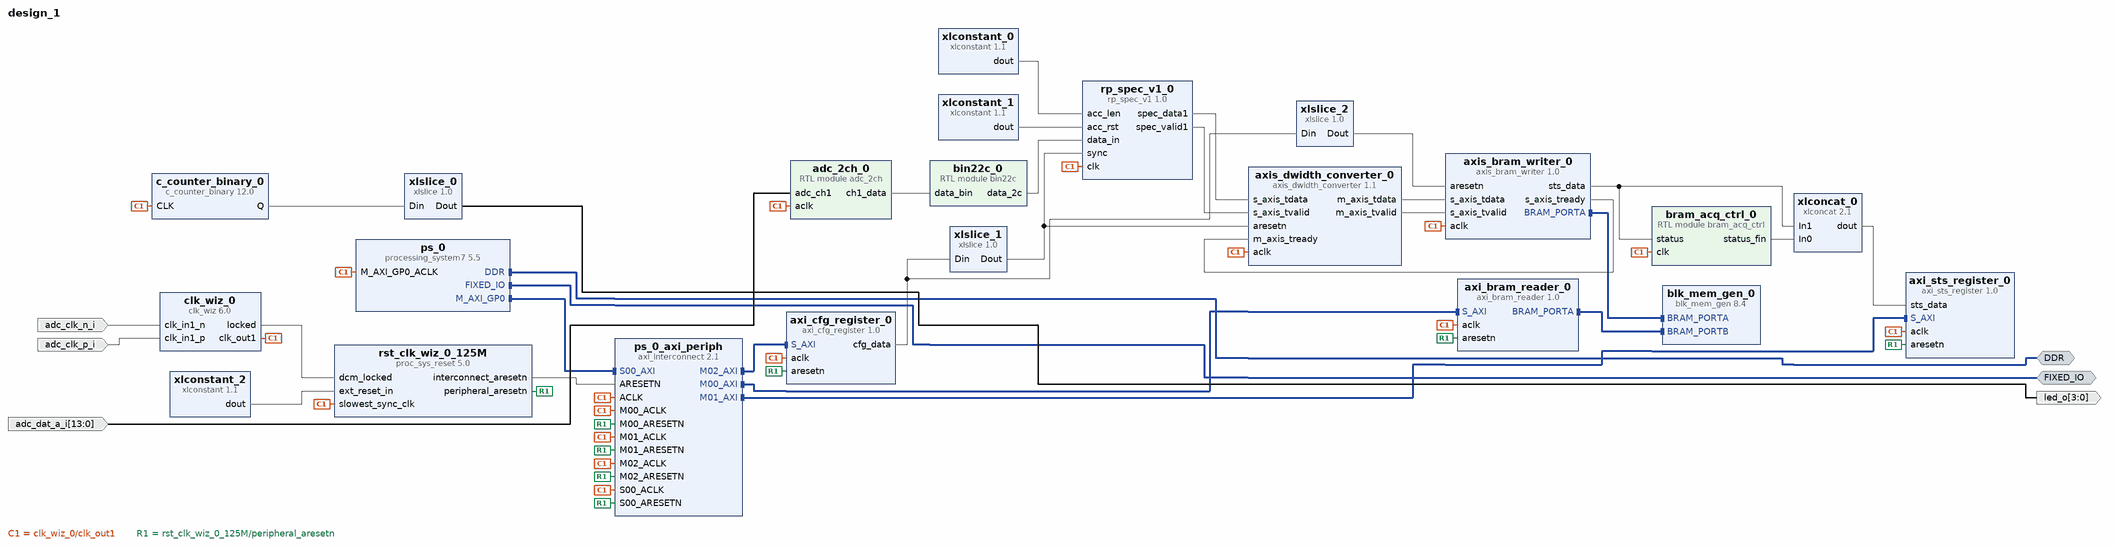
[diagram p0: block diagram of the top level]
# Vivado block design design_1, xc7z010clg400-1, Vivado 2018.2
create_bd_design design_1

create_bd_intf_port -mode Master -vlnv xilinx.com:interface:ddrx_rtl:1.0 DDR
create_bd_intf_port -mode Master -vlnv xilinx.com:display_processing_system7:fixedio_rtl:1.0 FIXED_IO
create_bd_port -dir I -type clk adc_clk_n_i
create_bd_port -dir I -type clk adc_clk_p_i
create_bd_port -dir I -from 13 -to 0 adc_dat_a_i
create_bd_port -dir O -from 3 -to 0 led_o

create_bd_cell -type ip -vlnv xilinx.com:ip:xlconstant:1.1 xlconstant_0
set_property -dict {CONFIG.CONST_WIDTH 32 CONFIG.CONST_VAL 4096} [get_bd_cells xlconstant_0]
create_bd_cell -type ip -vlnv xilinx.com:ip:clk_wiz:6.0 clk_wiz_0
set_property -dict [list \
  CONFIG.PRIMITIVE MMCM \
  CONFIG.PRIM_IN_FREQ 125 \
  CONFIG.CLKIN1_JITTER_PS 80.0 \
  CONFIG.CLKOUT1_REQUESTED_OUT_FREQ 125 \
  CONFIG.PRIM_SOURCE Differential_clock_capable_pin \
  CONFIG.CLKOUT1_DRIVES BUFG \
  CONFIG.CLKOUT2_DRIVES BUFG \
  CONFIG.CLKOUT3_DRIVES BUFG \
  CONFIG.CLKOUT4_DRIVES BUFG \
  CONFIG.CLKOUT5_DRIVES BUFG \
  CONFIG.CLKOUT6_DRIVES BUFG \
  CONFIG.CLKOUT7_DRIVES BUFG \
  CONFIG.FEEDBACK_SOURCE FDBK_AUTO \
  CONFIG.USE_RESET false \
  CONFIG.MMCM_DIVCLK_DIVIDE 1 \
  CONFIG.MMCM_CLKFBOUT_MULT_F 8.000 \
  CONFIG.MMCM_CLKIN1_PERIOD 8.000 \
  CONFIG.MMCM_CLKIN2_PERIOD 10.000 \
  CONFIG.MMCM_COMPENSATION ZHOLD \
  CONFIG.MMCM_CLKOUT0_DIVIDE_F 8.000 \
  CONFIG.CLKOUT1_JITTER 119.348 \
  CONFIG.CLKOUT1_PHASE_ERROR 96.948 \
] [get_bd_cells clk_wiz_0]
create_bd_cell -type ip -vlnv xilinx.com:ip:processing_system7:5.5 ps_0
set_property -dict [list \
  CONFIG.PCW_UIPARAM_DDR_FREQ_MHZ 533.333333 \
  CONFIG.PCW_APU_PERIPHERAL_FREQMHZ 666.666666 \
  CONFIG.PCW_SDIO_PERIPHERAL_FREQMHZ 100 \
  CONFIG.PCW_UART_PERIPHERAL_FREQMHZ 100 \
  CONFIG.PCW_I2C_PERIPHERAL_FREQMHZ 111.111115 \
  CONFIG.PCW_FPGA0_PERIPHERAL_FREQMHZ 50 \
  CONFIG.PCW_FPGA1_PERIPHERAL_FREQMHZ 50 \
  CONFIG.PCW_IMPORT_BOARD_PRESET /home/mugundhan/vivado_projects/red_pitaya/red-pitaya-notes-master/cfg/red_pitaya.xml \
  CONFIG.PCW_PRESET_BANK1_VOLTAGE {LVCMOS 2.5V} \
  CONFIG.PCW_UIPARAM_DDR_BUS_WIDTH {16 Bit} \
  CONFIG.PCW_UIPARAM_DDR_PARTNO {MT41J256M16 RE-125} \
  CONFIG.PCW_QSPI_PERIPHERAL_ENABLE 0 \
  CONFIG.PCW_ENET0_PERIPHERAL_ENABLE 1 \
  CONFIG.PCW_ENET0_ENET0_IO {MIO 16 .. 27} \
  CONFIG.PCW_ENET0_GRP_MDIO_ENABLE 1 \
  CONFIG.PCW_ENET0_GRP_MDIO_IO {MIO 52 .. 53} \
  CONFIG.PCW_ENET_RESET_ENABLE 1 \
  CONFIG.PCW_ENET_RESET_SELECT {Share reset pin} \
  CONFIG.PCW_ENET0_RESET_ENABLE 0 \
  CONFIG.PCW_SD0_PERIPHERAL_ENABLE 1 \
  CONFIG.PCW_SD0_SD0_IO {MIO 40 .. 45} \
  CONFIG.PCW_SD0_GRP_CD_ENABLE 1 \
  CONFIG.PCW_SD0_GRP_CD_IO {MIO 46} \
  CONFIG.PCW_SD0_GRP_WP_ENABLE 1 \
  CONFIG.PCW_SD0_GRP_WP_IO {MIO 47} \
  CONFIG.PCW_UART0_PERIPHERAL_ENABLE 1 \
  CONFIG.PCW_UART0_UART0_IO {MIO 14 .. 15} \
  CONFIG.PCW_UART1_PERIPHERAL_ENABLE 1 \
  CONFIG.PCW_UART1_UART1_IO {MIO 8 .. 9} \
  CONFIG.PCW_SPI0_PERIPHERAL_ENABLE 1 \
  CONFIG.PCW_SPI0_SPI0_IO EMIO \
  CONFIG.PCW_SPI1_PERIPHERAL_ENABLE 1 \
  CONFIG.PCW_SPI1_SPI1_IO {MIO 10 .. 15} \
  CONFIG.PCW_USB0_PERIPHERAL_ENABLE 1 \
  CONFIG.PCW_USB0_USB0_IO {MIO 28 .. 39} \
  CONFIG.PCW_USB_RESET_ENABLE 1 \
  CONFIG.PCW_USB_RESET_SELECT {Share reset pin} \
  CONFIG.PCW_USB0_RESET_ENABLE 1 \
  CONFIG.PCW_USB0_RESET_IO {MIO 48} \
  CONFIG.PCW_I2C0_PERIPHERAL_ENABLE 1 \
  CONFIG.PCW_I2C0_I2C0_IO {MIO 50 .. 51} \
  CONFIG.PCW_I2C0_GRP_INT_ENABLE 0 \
  CONFIG.PCW_I2C_RESET_ENABLE 1 \
  CONFIG.PCW_I2C_RESET_SELECT {Share reset pin} \
  CONFIG.PCW_GPIO_PERIPHERAL_ENABLE 1 \
  CONFIG.PCW_GPIO_MIO_GPIO_ENABLE 1 \
  CONFIG.PCW_GPIO_MIO_GPIO_IO MIO \
  CONFIG.PCW_GPIO_EMIO_GPIO_ENABLE 1 \
  CONFIG.PCW_GPIO_EMIO_GPIO_IO 64 \
] [get_bd_cells ps_0]
# 429 more settings of ps_0 are not shown: defaults, MIO pin electricals, DDR timing, and values the tool derives
create_bd_cell -type module -reference adc_2ch adc_2ch_0
create_bd_cell -type module -reference bin22c bin22c_0
create_bd_cell -type ip -vlnv xilinx.com:ip:c_counter_binary:12.0 c_counter_binary_0
set_property -dict {CONFIG.Output_Width 32 CONFIG.CE false} [get_bd_cells c_counter_binary_0]
create_bd_cell -type ip -vlnv xilinx.com:ip:xlslice:1.0 xlslice_0
set_property -dict {CONFIG.DIN_TO 26 CONFIG.DIN_FROM 29 CONFIG.DOUT_WIDTH 4} [get_bd_cells xlslice_0]
create_bd_cell -type ip -vlnv xilinx.com:ip:xlconstant:1.1 xlconstant_1
set_property -dict {CONFIG.CONST_WIDTH 1 CONFIG.CONST_VAL 0} [get_bd_cells xlconstant_1]
create_bd_cell -type ip -vlnv User_Company:SysGen:rp_spec_v1:1.0 rp_spec_v1_0
create_bd_cell -type ip -vlnv xilinx.com:ip:blk_mem_gen:8.4 blk_mem_gen_0
set_property -dict [list \
  CONFIG.Memory_Type True_Dual_Port_RAM \
  CONFIG.Enable_32bit_Address false \
  CONFIG.Use_Byte_Write_Enable true \
  CONFIG.Byte_Size 8 \
  CONFIG.Write_Width_A 64 \
  CONFIG.Write_Depth_A 1024 \
  CONFIG.Read_Width_A 64 \
  CONFIG.Enable_A Always_Enabled \
  CONFIG.Write_Width_B 32 \
  CONFIG.Read_Width_B 32 \
  CONFIG.Enable_B Always_Enabled \
  CONFIG.Register_PortA_Output_of_Memory_Primitives true \
  CONFIG.Register_PortB_Output_of_Memory_Primitives false \
  CONFIG.Use_RSTA_Pin false \
  CONFIG.Additional_Inputs_for_Power_Estimation false \
  CONFIG.Port_B_Clock 100 \
  CONFIG.Port_B_Write_Rate 50 \
  CONFIG.Port_B_Enable_Rate 100 \
  CONFIG.use_bram_block Stand_Alone \
] [get_bd_cells blk_mem_gen_0]
create_bd_cell -type ip -vlnv pavel-demin:user:axis_bram_writer:1.0 axis_bram_writer_0
set_property -dict [list \
  CONFIG.AXIS_TDATA_WIDTH 64 \
  CONFIG.BRAM_DATA_WIDTH 64 \
  CONFIG.BRAM_ADDR_WIDTH 10 \
] [get_bd_cells axis_bram_writer_0]
create_bd_cell -type ip -vlnv pavel-demin:user:axi_bram_reader:1.0 axi_bram_reader_0
set_property -dict {CONFIG.AXI_ADDR_WIDTH 32 CONFIG.BRAM_ADDR_WIDTH 11} [get_bd_cells axi_bram_reader_0]
create_bd_cell -type ip -vlnv pavel-demin:user:axi_sts_register:1.0 axi_sts_register_0
set_property -dict {CONFIG.STS_DATA_WIDTH 32 CONFIG.AXI_ADDR_WIDTH 32} [get_bd_cells axi_sts_register_0]
create_bd_cell -type ip -vlnv xilinx.com:ip:axi_interconnect:2.1 ps_0_axi_periph
set_property -dict {CONFIG.NUM_MI 3} [get_bd_cells ps_0_axi_periph]
create_bd_cell -type ip -vlnv xilinx.com:ip:proc_sys_reset:5.0 rst_clk_wiz_0_125M
create_bd_cell -type ip -vlnv xilinx.com:ip:xlconstant:1.1 xlconstant_2
create_bd_cell -type ip -vlnv pavel-demin:user:axi_cfg_register:1.0 axi_cfg_register_0
set_property -dict {CONFIG.CFG_DATA_WIDTH 32 CONFIG.AXI_ADDR_WIDTH 32} [get_bd_cells axi_cfg_register_0]
create_bd_cell -type ip -vlnv xilinx.com:ip:xlslice:1.0 xlslice_1
create_bd_cell -type ip -vlnv xilinx.com:ip:xlslice:1.0 xlslice_2
set_property -dict {CONFIG.DIN_TO 1 CONFIG.DIN_FROM 1} [get_bd_cells xlslice_2]
create_bd_cell -type ip -vlnv xilinx.com:ip:axis_dwidth_converter:1.1 axis_dwidth_converter_0
set_property -dict {CONFIG.S_TDATA_NUM_BYTES 4 CONFIG.M_TDATA_NUM_BYTES 8} [get_bd_cells axis_dwidth_converter_0]
create_bd_cell -type module -reference bram_acq_ctrl bram_acq_ctrl_0
create_bd_cell -type ip -vlnv xilinx.com:ip:xlconcat:2.1 xlconcat_0
set_property -dict {CONFIG.IN0_WIDTH 1 CONFIG.IN1_WIDTH 10} [get_bd_cells xlconcat_0]

# ---- connections ----

connect_bd_intf_net [get_bd_intf_pins ps_0/M_AXI_GP0] [get_bd_intf_pins ps_0_axi_periph/S00_AXI]
connect_bd_intf_net [get_bd_intf_pins ps_0_axi_periph/M00_AXI] [get_bd_intf_pins axi_bram_reader_0/S_AXI]
connect_bd_intf_net [get_bd_intf_pins ps_0_axi_periph/M01_AXI] [get_bd_intf_pins axi_sts_register_0/S_AXI]
connect_bd_intf_net [get_bd_intf_pins ps_0_axi_periph/M02_AXI] [get_bd_intf_pins axi_cfg_register_0/S_AXI]
connect_bd_intf_net [get_bd_intf_pins axis_bram_writer_0/BRAM_PORTA] [get_bd_intf_pins blk_mem_gen_0/BRAM_PORTA]
connect_bd_intf_net [get_bd_intf_pins blk_mem_gen_0/BRAM_PORTB] [get_bd_intf_pins axi_bram_reader_0/BRAM_PORTA]
connect_bd_intf_net [get_bd_intf_ports DDR] [get_bd_intf_pins ps_0/DDR]
connect_bd_intf_net [get_bd_intf_ports FIXED_IO] [get_bd_intf_pins ps_0/FIXED_IO]
connect_bd_net [get_bd_pins clk_wiz_0/clk_out1] \
  [get_bd_pins adc_2ch_0/aclk] [get_bd_pins ps_0/M_AXI_GP0_ACLK] [get_bd_pins c_counter_binary_0/CLK] \
  [get_bd_pins rp_spec_v1_0/clk] [get_bd_pins axis_bram_writer_0/aclk] [get_bd_pins axi_bram_reader_0/aclk] \
  [get_bd_pins axi_sts_register_0/aclk] [get_bd_pins rst_clk_wiz_0_125M/slowest_sync_clk] \
  [get_bd_pins axi_cfg_register_0/aclk] [get_bd_pins axis_dwidth_converter_0/aclk] [get_bd_pins bram_acq_ctrl_0/clk] \
  [get_bd_pins ps_0_axi_periph/ACLK] [get_bd_pins ps_0_axi_periph/S00_ACLK] [get_bd_pins ps_0_axi_periph/M00_ACLK] \
  [get_bd_pins ps_0_axi_periph/M01_ACLK] [get_bd_pins ps_0_axi_periph/M02_ACLK]
connect_bd_net -net clk_in1_n_0_1 [get_bd_ports adc_clk_n_i] [get_bd_pins clk_wiz_0/clk_in1_n]
connect_bd_net -net clk_in1_p_0_1 [get_bd_ports adc_clk_p_i] [get_bd_pins clk_wiz_0/clk_in1_p]
connect_bd_net -net adc_ch1_0_1 [get_bd_ports adc_dat_a_i] [get_bd_pins adc_2ch_0/adc_ch1]
connect_bd_net [get_bd_pins adc_2ch_0/ch1_data] [get_bd_pins bin22c_0/data_bin]
connect_bd_net [get_bd_pins c_counter_binary_0/Q] [get_bd_pins xlslice_0/Din]
connect_bd_net [get_bd_pins xlslice_0/Dout] [get_bd_ports led_o]
connect_bd_net [get_bd_pins xlconstant_0/dout] [get_bd_pins rp_spec_v1_0/acc_len]
connect_bd_net [get_bd_pins xlconstant_1/dout] [get_bd_pins rp_spec_v1_0/acc_rst]
connect_bd_net [get_bd_pins bin22c_0/data_2c] [get_bd_pins rp_spec_v1_0/data_in]
connect_bd_net [get_bd_pins rst_clk_wiz_0_125M/peripheral_aresetn] \
  [get_bd_pins axi_cfg_register_0/aresetn] [get_bd_pins axi_sts_register_0/aresetn] [get_bd_pins axi_bram_reader_0/aresetn] \
  [get_bd_pins ps_0_axi_periph/S00_ARESETN] [get_bd_pins ps_0_axi_periph/M00_ARESETN] \
  [get_bd_pins ps_0_axi_periph/M01_ARESETN] [get_bd_pins ps_0_axi_periph/M02_ARESETN]
connect_bd_net [get_bd_pins rst_clk_wiz_0_125M/interconnect_aresetn] [get_bd_pins ps_0_axi_periph/ARESETN]
connect_bd_net [get_bd_pins xlconstant_2/dout] [get_bd_pins rst_clk_wiz_0_125M/ext_reset_in]
connect_bd_net [get_bd_pins clk_wiz_0/locked] [get_bd_pins rst_clk_wiz_0_125M/dcm_locked]
connect_bd_net [get_bd_pins axi_cfg_register_0/cfg_data] [get_bd_pins xlslice_1/Din] [get_bd_pins xlslice_2/Din]
connect_bd_net [get_bd_pins xlslice_1/Dout] [get_bd_pins rp_spec_v1_0/sync] [get_bd_pins axis_dwidth_converter_0/aresetn]
connect_bd_net [get_bd_pins xlslice_2/Dout] [get_bd_pins axis_bram_writer_0/aresetn]
connect_bd_net [get_bd_pins rp_spec_v1_0/spec_data1] [get_bd_pins axis_dwidth_converter_0/s_axis_tdata]
connect_bd_net [get_bd_pins rp_spec_v1_0/spec_valid1] [get_bd_pins axis_dwidth_converter_0/s_axis_tvalid]
connect_bd_net [get_bd_pins axis_dwidth_converter_0/m_axis_tdata] [get_bd_pins axis_bram_writer_0/s_axis_tdata]
connect_bd_net [get_bd_pins axis_bram_writer_0/s_axis_tready] [get_bd_pins axis_dwidth_converter_0/m_axis_tready]
connect_bd_net [get_bd_pins axis_dwidth_converter_0/m_axis_tvalid] [get_bd_pins axis_bram_writer_0/s_axis_tvalid]
connect_bd_net [get_bd_pins bram_acq_ctrl_0/status_fin] [get_bd_pins xlconcat_0/In0]
connect_bd_net [get_bd_pins xlconcat_0/dout] [get_bd_pins axi_sts_register_0/sts_data]
connect_bd_net [get_bd_pins axis_bram_writer_0/sts_data] [get_bd_pins xlconcat_0/In1] [get_bd_pins bram_acq_ctrl_0/status]

# ---- address map ----
assign_bd_address -offset 0x40001000 -range 4K -target_address_space [get_bd_addr_spaces ps_0/Data] [get_bd_addr_segs axi_sts_register_0/s_axi/reg0]
assign_bd_address -offset 0x40002000 -range 8K -target_address_space [get_bd_addr_spaces ps_0/Data] [get_bd_addr_segs axi_bram_reader_0/s_axi/reg0]
assign_bd_address -offset 0x40004000 -range 4K -target_address_space [get_bd_addr_spaces ps_0/Data] [get_bd_addr_segs axi_cfg_register_0/s_axi/reg0]

validate_bd_design
save_bd_design
